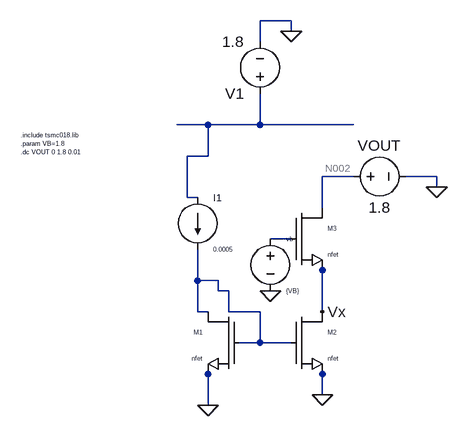
[diagram p0: schematic ckt.asc]
ckt.asc, the LTspice schematic file:
Version 4.1
SHEET 1 880 680
WIRE 272 -240 224 -240
WIRE 272 -224 272 -240
WIRE 224 -208 224 -240
WIRE 144 -80 96 -80
WIRE 224 -80 224 -128
WIRE 224 -80 144 -80
WIRE 368 -80 224 -80
WIRE 144 -32 144 -80
WIRE 144 -32 112 -32
WIRE 368 0 320 0
WIRE 496 0 448 0
WIRE 496 16 496 0
WIRE 112 32 112 -32
WIRE 128 32 112 32
WIRE 320 48 320 0
WIRE 272 96 240 96
WIRE 128 160 128 112
WIRE 160 160 128 160
WIRE 160 176 160 160
WIRE 176 176 160 176
WIRE 128 208 128 160
WIRE 144 208 128 208
WIRE 176 208 176 176
WIRE 224 208 176 208
WIRE 320 208 320 144
WIRE 224 256 224 208
WIRE 224 256 192 256
WIRE 272 256 224 256
WIRE 320 336 320 304
WIRE 144 352 144 304
FLAG 320 336 0
FLAG 144 352 0
FLAG 240 176 0
FLAG 320 208 Vx
FLAG 272 -224 0
FLAG 496 16 0
SYMBOL nmost3 272 48 R0
SYMATTR InstName M3
SYMATTR Value nfet
SYMATTR Value2 l=0.18u w=5u
SYMBOL nmost3 272 208 R0
SYMATTR InstName M2
SYMATTR Value nfet
SYMATTR Value2 l=0.18u w=5u
SYMBOL nmost3 192 208 M0
SYMATTR InstName M1
SYMATTR Value nfet
SYMATTR Value2 l=0.18u w=5u
SYMBOL current 128 32 R0
WINDOW 0 24 0 Left 1
WINDOW 3 24 80 Left 0
WINDOW 123 0 0 Left 0
WINDOW 39 0 0 Left 0
SYMATTR InstName I1
SYMATTR Value 0.0005
SYMBOL voltage 240 80 R0
WINDOW 0 24 16 Left 0
WINDOW 3 24 96 Left 0
WINDOW 123 0 0 Left 0
WINDOW 39 0 0 Left 0
SYMATTR InstName vb
SYMATTR Value {VB}
SYMBOL voltage 224 -112 R180
WINDOW 123 0 0 Left 0
WINDOW 39 0 0 Left 0
SYMATTR InstName V1
SYMATTR Value 1.8
SYMBOL voltage 352 0 R270
WINDOW 0 32 56 VTop 2
WINDOW 3 -32 56 VBottom 2
WINDOW 123 0 0 Left 0
WINDOW 39 0 0 Left 0
SYMATTR InstName VOUT
SYMATTR Value 1.8
TEXT -144 -64 Left 0 !.include tsmc018.lib\n.param VB=1.8\n.dc VOUT 0 1.8 0.01

The netlist it stands for:
* ckt.asc
M3 N002 N003 Vx Vx nfet l=0.18u w=5u
M2 Vx N004 0 0 nfet l=0.18u w=5u
M1 N004 N004 0 0 nfet l=0.18u w=5u
I1 N001 N004 0.0005
vb N003 0 {VB}
V1 N001 0 1.8
VOUT N002 0 1.8
.model NMOS NMOS
.model PMOS PMOS
.lib standard.mos
.include tsmc018.lib
.param VB=1.8
.dc VOUT 0 1.8 0.01
.backanno
.end

* Results of the author's LTspice run, read from the files saved beside the schematic
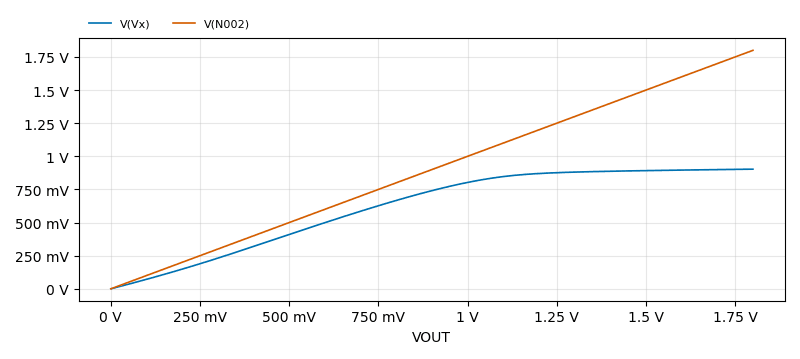
[diagram p1: DC transfer characteristic of ckt.asc, plotted from the saved traces]
* DC transfer characteristic, 1 run:
*   V(Vx): 0.03268 fV at VOUT=0 V, 903.2 mV at VOUT=1.8 V, min 0.03268 fV, max 903.2 mV
*   V(N002): 0 V at VOUT=0 V, 1.8 V at VOUT=1.8 V, min 0 V, max 1.8 V